# EAGLE design encoder (EAGLE 7.6.0)
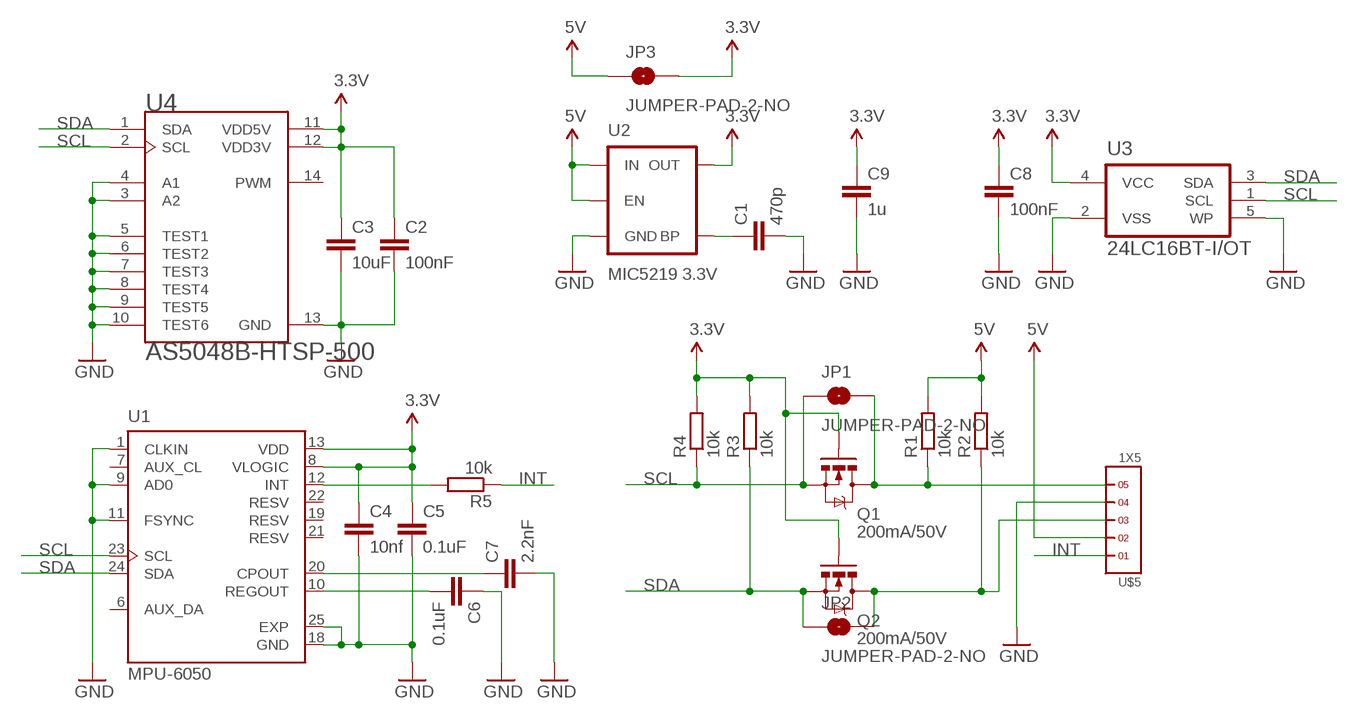
[diagram p0: schematic, sheet 1]

## Parts
C1  470p  C-EUC0402K  [C0402K]
C2  100nF  C-EUC0402K  [C0402K]
C3  10uF  C-EUC0603K  [C0603K]
C4  10nf  C-EUC0402K  [C0402K]
C5  0.1uF  C-EUC0402K  [C0402K]
C6  0.1uF  C-EUC0402K  [C0402K]
C7  2.2nF  C-EUC0402K  [C0402K]
C8  100nF  C-EUC0402K  [C0402K]
C9  1u  C-EUC0402K  [C0402K]
JP1  JUMPER-PAD-2-NO  [PAD-JUMPER-2-NO_NO_SILK]
JP2  JUMPER-PAD-2-NO  [PAD-JUMPER-2-NO_NO_SILK]
JP3  JUMPER-PAD-2-NO  [PAD-JUMPER-2-NO_NO_SILK]
Q1  200mA/50V  MOSFET-NCHANNELBSS138  [SOT23-3]
Q2  200mA/50V  MOSFET-NCHANNELBSS138  [SOT23-3]
R1  10k  R-EU_R0402  [R0402]
R2  10k  R-EU_R0402  [R0402]
R3  10k  R-EU_R0402  [R0402]
R4  10k  R-EU_R0402  [R0402]
R5  10k  R-EU_R0402  [R0402]
U1  MPU-6050  [QFN50P400X400X95-25N]
U2  MIC5219 3.3V  V_REG_MIC52193.3V  [SOT23-5]
U3  24LC16BT-I/OT  [SOT-23-5]
U4  AS5048B-HTSP-500  [SOP65P640X120-14N]
U$5  1X5  [1X5]

## Nets
3.3V: C2.1 C3.1 C4.1 C5.1 C8.1 C9.1 JP3.2 Q1.1(G) Q2.1(G) R3.2 R4.2 U1.8(VLOGIC) U1.13(VDD) U2.5(OUT) U3.4(VCC) U4.11(VDD5V) U4.12(VDD3V)
5V: JP3.1 R1.2 R2.2 U2.1(IN) U2.3(EN) U$5.2
GND: C1.2 C2.2 C3.2 C4.2 C5.2 C6.1 C7.2 C8.2 C9.2 U1.1(CLKIN) U1.9(AD0) U1.11(FSYNC) U1.18(GND) U1.25(EXP) U2.2(GND) U3.2(VSS) U3.5(WP) U4.3(A2) U4.4(A1) U4.5(TEST1) U4.6(TEST2) U4.7(TEST3) U4.8(TEST4) U4.9(TEST5) U4.10(TEST6) U4.13(GND) U$5.4
INT: R5.1 U$5.1
N$1: C1.1 U2.4(BP)
N$2: C7.1 U1.20(CPOUT)
N$3: R5.2 U1.12(INT)
N$4: C6.2 U1.10(REGOUT)
SCL: JP1.1 Q1.2(S) R4.1 U1.23(SCL) U3.1(SCL) U4.2(SCL)
SCL_: JP1.2 Q1.3(D) R1.1 U$5.5
SDA: JP2.1 Q2.2(S) R3.1 U1.24(SDA) U3.3(SDA) U4.1(SDA)
SDA_: JP2.2 Q2.3(D) R2.1 U$5.3
Unconnected: U1.6(AUX_DA) U1.7(AUX_CL) U1.19(RESV) U1.21(RESV) U1.22(RESV) U4.14(PWM)

## Library data of the parts
C1-C9 = rcl:C-EU: CAPACITOR, European symbol
JP1-JP3 = SparkFun-Passives:JUMPER-PAD-2-NO
Q1 Q2 = SparkFun-DiscreteSemi:MOSFET-NCHANNEL: Common NMOSFET Parts MFG P/N Store ID Prod ID FDD8780 TRANS-09984 SI7820DN TRANS-11055 FDS6630A IC-08089 2N7002PW TRANS-11151 FQP30N06L COM-10213 TRANS-10060 BSS123LT1G TRANS-08345 BSS138 TRANS-00830 BS170 2N7000; PROD_ID: TRANS-00830
R1-R5 = rcl:R-EU_: RESISTOR, European symbol
U1 = MPU-6050:MPU-6050: MPU-6050 Six-Axis (Gyro + Accelerometer) MEMS MotionTracking™ Devices
U2 = SparkFun-PowerIC:V_REG_MIC5219: V_REG MIC5219 Standard 3.3V and 5V 500mA LDO voltage regulator in SOT-23 layout. Micrel part MIC5219. BP (by-pass) pin is used to lower output noise with 470pF cap, may be left open.; PROD_ID: VREG-09872
U3 = 24LC16BT-I_OT:24LC16BT-I/OT: 16K I2C Serial EEPROM
U4 = AS5048-HTSP-500:AS5048B-HTSP-500: AS5048B Series 360° 3.3 / 5 V 14 bit Magnetic Rotary Encoder - TSSOP-14
U$5 = headers(.05in):1X5

## Board
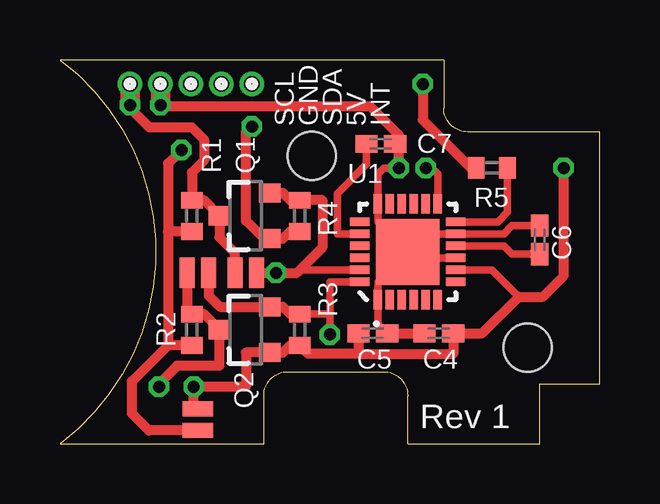
[diagram p1: board, top side]
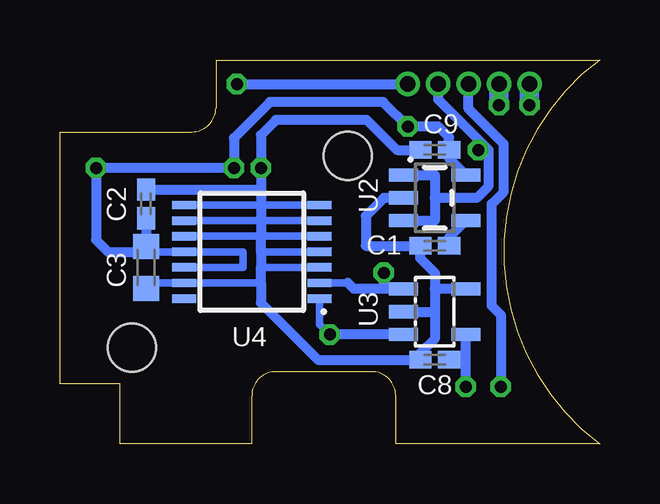
[diagram p2: board, bottom side, seen from below]

Size 22.5 x 16 mm. Coordinates in mm from the lower left corner, seen from the top.
Outline: 0,0 8.5,0 8.5,2 arc-90 9.5,3 13.5,3 arc-90 14.5,2 14.5,0 20,0 20,2.5 22.5,2.5 22.5,13 17,13 arc-90 16,14 16,16 0,16 arc-106 0,0
Copper layers (1*16): Top 0.0356mm / dielectric 1.5011mm / Bottom 0.0356mm
Design rules "OSHPark-2layer": minimum track width 6mil, minimum drill 13mil, track to track 6mil, track to pad 6mil, pad to pad 6mil, via to via 6mil, smd to smd 6mil, copper to edge 15mil, drill to drill 6mil, minimum pad ring 7mil, minimum via ring 7mil, stop-mask expansion 2.5mil, vias tented up to drill 0mil, thermal gap 10mil
Holes 2 mm at 19.5,4 10.5,12

### Footprints (pad centres in the part's own frame; a part is rotated, then mirrored left to right if it is on the bottom)
C0402K = smd 0.925 x 0.74: 1 -0.6,0; 2 0.6,0
C0603K = smd 1.05 x 1.08: 1 -0.875,0; 2 0.875,0
PAD-JUMPER-2-NO_NO_SILK = smd 0.635 x 1.27: 1 -0.45,0; 2 0.45,0
SOT23-3 = smd 0.8 x 0.9: 1 -0.95,-1; 2 0.95,-1; 3 0,1.1
R0402 = smd 0.7 x 0.9: 1 -0.65,0; 2 0.65,0
QFN50P400X400X95-25N = smd 0.8 x 0.35: 1 -2,1.25; 2 -2,0.75; 3 -2,0.25; 4 -2,-0.25; 5 -2,-0.75; 6 -2,-1.25; 13 2,-1.25; 14 2,-0.75; 15 2,-0.25; 16 2,0.25; 17 2,0.75; 18 2,1.25 | smd 0.35 x 0.8: 7 -1.25,-2; 8 -0.75,-2; 9 -0.25,-2; 10 0.25,-2; 11 0.75,-2; 12 1.25,-2; 19 1.25,2; 20 0.75,2; 21 0.25,2; 22 -0.25,2; 23 -0.75,2; 24 -1.25,2 | smd 2.75 x 2.65: 25 0,0
SOT23-5 = smd 0.55 x 1.2: 1 -0.95,-1.3; 2 0,-1.3; 3 0.95,-1.3; 4 0.95,1.3; 5 -0.95,1.3
SOT-23-5 = smd 0.55 x 1.2: 1 -0.95,-1.3; 2 0,-1.3; 3 0.95,-1.3; 4 0.95,1.3; 5 -0.95,1.3
SOP65P640X120-14N = smd 1 x 0.35: 1 -2.825,1.95; 2 -2.825,1.3; 3 -2.825,0.65; 4 -2.825,0; 5 -2.825,-0.65; 6 -2.825,-1.3; 7 -2.825,-1.95; 8 2.825,-1.95; 9 2.825,-1.3; 10 2.825,-0.65; 11 2.825,0; 12 2.825,0.65; 13 2.825,1.3; 14 2.825,1.95
1X5 = drill 0.635 pad 1.016: 1 0,0; 2 1.27,0; 3 2.54,0; 4 3.81,0; 5 5.08,0

### Placement (x,y rotation side)
C1  6.88,8.25 180 bottom
C2  18.91,10 90 bottom
C3  18.91,7.35 270 bottom
C4  15.8,4.6 180 top
C5  13.05,4.6 0 top
C6  20,8.5 270 top
C7  13.38,12.5 0 top
C8  6.88,3.5 180 bottom
C9  6.88,12.25 180 bottom
JP1  7.75,7.12 180 top
JP2  5.75,7.12 180 top
JP3  5.75,1 90 top
Q1  7.75,9.5 90 top
Q2  7.75,4.75 90 top
R1  5.5,9.5 270 top
R2  5.5,4.75 270 top
R3  10,4.75 270 top
R4  10,9.5 270 top
R5  18,11.5 0 top
U1  14.5,8 90 top
U2  6.88,10.25 270 bottom
U3  6.88,5.5 270 bottom
U4  14.5,8 180 bottom
U$5  8,15 180 top

### Tracks (layer width: path | path; a pad name or v marks a point on that pad's centre or on a via)
3.3V  (via drill 0.5)
  Top 0.305: U1.13 15.75,11.25 15.5,11.5 v15.25,11.5 | U1.8 18,7.25 19.12,6.12
  Top 0.406: C5.1 12.45,3.75 | 12.45,3.75 16.4,3.75 C4.1 17.6,4.6 19.12,6.12 20.12,6.12 21,7 v21,11.5 | 12.45,3.75 10.35,3.75 R3.2 9.6,4.1 9.3,3.8 Q2.1 7.75,3.8 7.75,2.38 v5.58,2.38 5.58,1.62 JP3.2 | R4.2 9.6,8.85 9.3,8.55 Q1.1 8.5,8.55 7.75,9.3 7.75,12.97 v8,13.22
  Bottom 0.305: U4.12 14.88,7.35 14.88,8 U4.11 18.91,8 C3.1 19.14,8
  Bottom 0.406: C2.1 C3.1 | 19.14,8 20.5,8 21,8.5 v21,11.5 v15.25,11.5 15.25,12.75 13.75,14.25 9.03,14.25 v8,13.22 6.72,13.22 6.28,12.78 C9.1 6.28,11.9 U2.5 | 5.58,3.5 U3.4 | C8.1 5.58,3.5 | v5.58,2.38 5.58,3.5
5V  (via drill 0.5)
  Top 0.406: 4.5,8.85 4.5,11.69 v5.06,12.25 | 4.5,8.85 4.5,4.1 | R1.2 4.5,8.85 | R2.2 4.5,4.1 | 4.5,4.1 3,2.6 3,1.25 3.7,0.55 JP3.1
  Bottom 0.305: v5.06,12.25 5.06,12.69
  Bottom 0.406: 6.88,10.25 6.88,9.3 U2.3 | 6.88,10.25 5.12,10.25 4.62,10.75 4.62,12.25 5.06,12.69 6.73,14.36 U$5.2 | U2.1 6.88,11.2 6.88,10.25
GND  (via drill 0.5)
  Top 0.305: 15.25,8.75 U1.25 | U1.9 14.75,7.75 U1.25 | U1.25 13.25,6.75 U1.1 13.25,5 C5.2 | U1.25 13.25,9.25 U1.18 13.25,11.25 13.5,11.5 v14.12,11.5 | U1.25 14.5,8.75 U1.11 18.5,8.75 18.85,9.1 C6.1 | 14,12.5 C7.2 14,12.53 14.12,12.53
  Top 0.406: C5.2 C4.2 | v14.12,11.5 14.12,12.53 14.12,12.88 12.94,14.06 4.19,14.06 v4.19,14.12
  Top 0.813: U$5.4 v4.19,14.12
  Bottom 0.305: U4.10 14.12,8.65 U4.5 | 14.12,6.7 U4.13 18.91,6.7 C3.2 | 7.47,3.52 C8.2 7.47,3.77 | U4.7 14.12,9.95 U4.8 | U4.6 14.12,9.3 U4.9 | U4.4 14.12,8 | U4.3 14.12,7.35
  Bottom 0.406: 14.12,10.6 v14.12,11.5 14.12,12.88 13.5,13.5 9.7,13.5 8.45,12.25 C9.2 7.5,12.25 | U2.2 9,10.25 9.75,9.5 9.75,8.25 C1.2 7.47,7.72 6.88,7.12 6.88,6.45 | 6.88,6.45 6.88,5.5 | 6.88,5.5 6.88,4.38 7.47,3.77 | C8.2 11.75,3.5 14.12,5.88 14.12,6.7 14.12,7.35 14.12,8 14.12,8.65 14.12,9.3 14.12,9.95 14.12,10.6 | U3.2 6.88,5.5 | U3.5 6.88,6.45 | C2.2 14.12,10.6
  Bottom 0.813: U$5.4 v4.19,14.12
INT  (via drill 0.5)
  Top 0.305: 17.12,11.5 R5.1
  Top 0.406: v15.12,15 15.12,13.5 17.12,11.5
  Bottom 0.406: v15.12,15 U$5.1
N$1
  Bottom 0.406: C1.1 6.28,8.6 U2.4
N$2
  Top 0.305: U1.20 11.56,8.75 11.56,10.44 12.78,11.65 C7.1
N$3
  Top 0.305: U1.12 18.25,9.25 18.65,9.65 R5.2
N$4
  Top 0.305: U1.10 18.5,8.25 18.85,7.9 C6.2
SCL  (via drill 0.5)
  Top 0.305: U1.23 10,7.25 9.88,7.12
  Top 0.406: JP1.1 v9,7.12 9.88,7.12 10.94,8.19 10.94,10.15 R4.1 9.6,10.15 9.3,10.45 Q1.2
  Bottom 0.305: U4.2 10.5,6.7
  Bottom 0.406: 9,6.45 10.25,6.45 10.5,6.7 | U3.1 9,6.45 | 9,6.45 v9,7.12
SCL_  (via drill 0.5)
  Top 0.406: JP1.2 7.3,7.95 6.65,8.6 Q1.3 6,10.15 R1.1 5.5,11.31 6,11.81 6,12.69 5.5,13.19 3.73,13.19 2.92,14 v2.92,14.12
  Top 0.813: U$5.5 v2.92,14.12
  Bottom 0.813: U$5.5 v2.92,14.12
SDA  (via drill 0.5)
  Top 0.305: v11.25,4.55 11.25,5.4 | 11.25,5.4 11.25,6.75 U1.24 | R3.1 11.25,5.4
  Top 0.406: R3.1 9.6,5.4 9.3,5.7 Q2.2 6.67,5.7 6.2,6.17 JP2.1
  Bottom 0.305: U4.1 11.68,4.97 v11.25,4.55
  Bottom 0.406: U3.3 v11.25,4.55
SDA_  (via drill 0.5)
  Top 0.305: v4.12,2.38 4.12,2.5
  Top 0.406: 4.12,2.5 4.88,3.25 6.65,3.25 Q2.3 6,5.4 R2.1 5.3,5.4 JP2.2
  Bottom 0.406: U$5.3 5.46,13.96 4,12.5 4,10.5 4.5,10 4.5,5.75 4.12,5.38 v4.12,2.38

### Text on the board
tNames: SCL | GND | SDA | 5V | INT | Rev 1